# Altium schematic sheet 最小系统.SchDoc
size A4
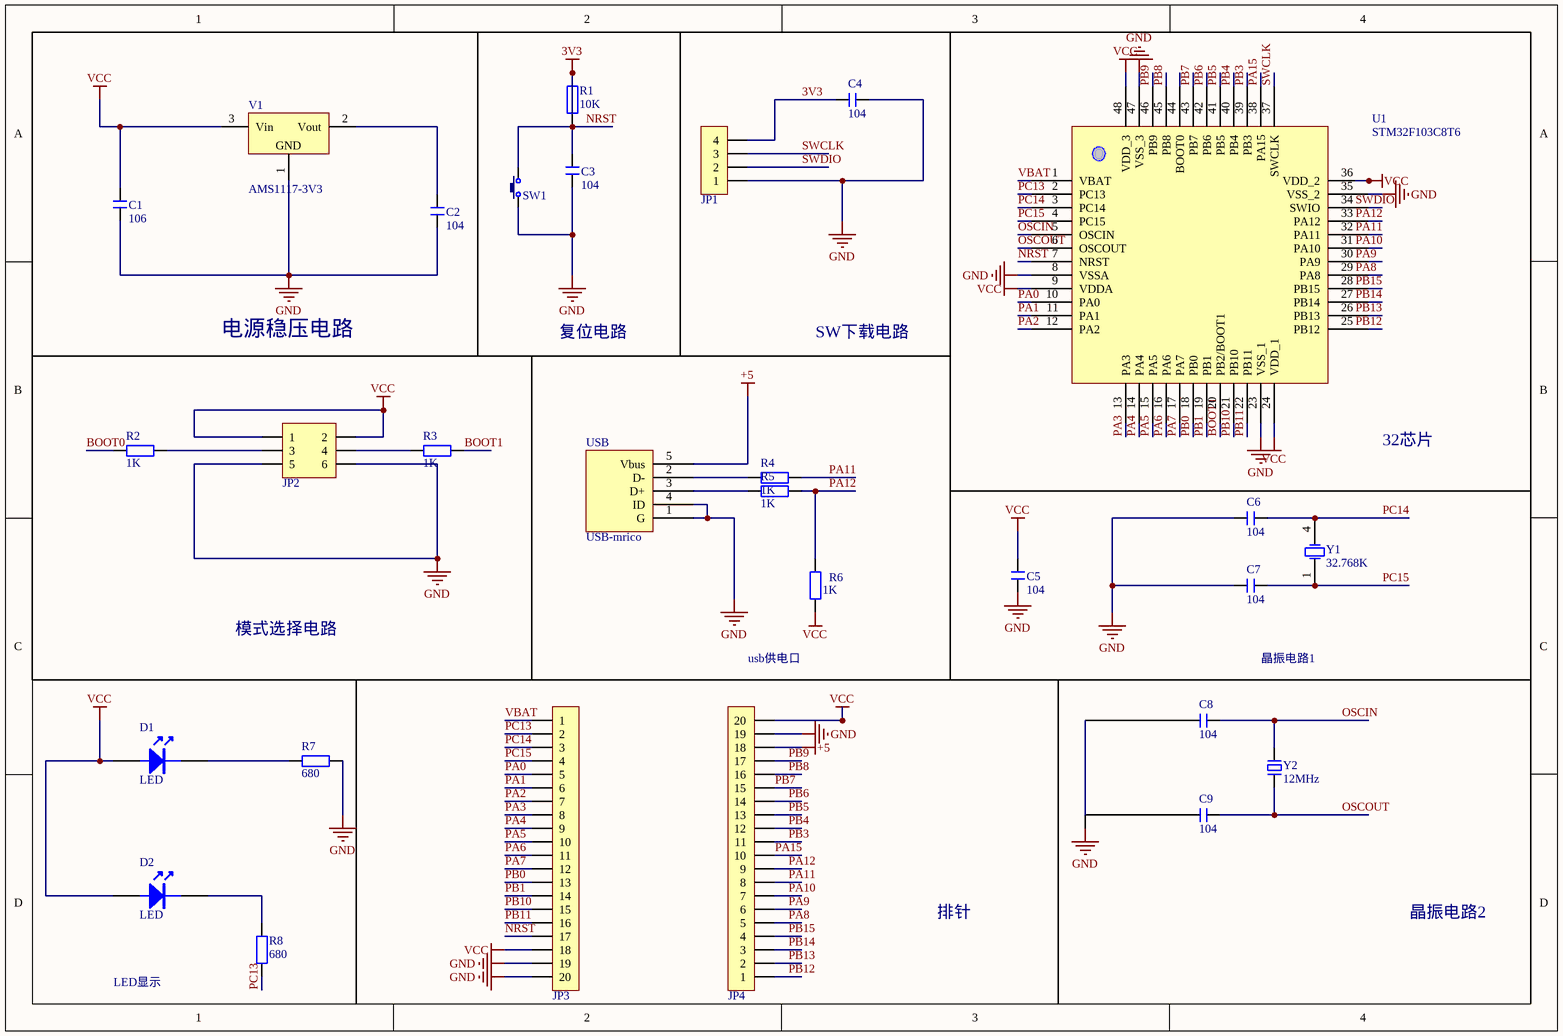
[diagram p0: 最小系统.SchDoc]

## Parts
C1  106  [C 0201_L]
C2  104  [C 0201_L]
C3  104  [C 0201_L]
C4  104  [C 0201_L]
C5  104  [C 0201_L]
C6  104  [C 0201_L]
C7  104  [C 0201_L]
C8  104  [C 0201_L]
C9  104  [C 0201_L]
D1  LED  [LED 0805G]
D2  LED  [LED 0805G]
JP1  HDR-1X4  [XH2.54-WI-4P]  (value not drawn)
JP2  Header3X2  [IDC2.54-LI-2x3P]  (value not drawn)
JP3  HDR-1X20  [HDR2.54-LI-20P]  (value not drawn)
JP4  HDR-1X20  [HDR2.54-LI-20P]  (value not drawn)
R1  10K  [R 0201_L]
R2  1K  [R 0201_L]
R3  1K  [R 0201_L]
R4  1K  [R 0201_L]
R5  1K  [R 0201_L]
R6  1K  [R 0201_L]
R7  680  [R 0201_L]
R8  680  [R 0201_L]
SW1  3x6x5  [TSW SMD-3*6*2.5]  (value not drawn)
U1  STM32F103C8T6  [TQFP48 7x7_L]
USB  USB-mrico  [USB-micro_B]
V1  AMS1117-3V3  [SOT223_L]
Y1  32.768K  [MC-306]
Y2  12MHz  [OSC HC-49S]

## Blocks framed on the sheet
电源稳压电路: C1 C2 V1

## Nets
3V3: C4.2 JP1.4 R1.2
+5: JP4.18 USB.5(Vbus)
GND: C1.1 C2.1 C3.1 C4.1 C5.1 C6.2 C7.2 JP1.1 JP2.5 JP2.6 JP3.19 JP3.20 JP4.19 R7.1 SW1.1 U1.8(VSSA) U1.23(VSS_1) U1.35(VSS_2) U1.47(VSS_3) USB.1(G) USB.4(ID) V1.1(GND)
VCC: C1.2 C5.2 D1.1 D2.1 JP2.1 JP2.2 JP3.18 JP4.20 R6.1 U1.9(VDDA) U1.24(VDD_1) U1.36(VDD_2) U1.48(VDD_3) V1.3(Vin)
BOOT0: R2.1
BOOT1: R3.2 U1.20(PB2/BOOT1)
NRST: C3.2 JP3.17 R1.1 SW1.2 U1.7(NRST)
OSCIN: C8.2 U1.5(OSCIN) Y2.2
OSCOUT: C9.2 U1.6(OSCOUT) Y2.1
PA0: JP3.5 U1.10(PA0)
PA1: JP3.6 U1.11(PA1)
PA2: JP3.7 U1.12(PA2)
PA3: JP3.8 U1.13(PA3)
PA4: JP3.9 U1.14(PA4)
PA5: JP3.10 U1.15(PA5)
PA6: JP3.11 U1.16(PA6)
PA7: JP3.12 U1.17(PA7)
PA8: JP4.5
PA9: JP4.6
PA10: JP4.7
PA11: JP4.8 R4.2
PA12: JP4.9 R5.2 R6.2
PA15: JP4.10 U1.38(PA15)
PB0: JP3.13 U1.18(PB0)
PB1: JP3.14 U1.19(PB1)
PB3: JP4.11 U1.39(PB3)
PB4: JP4.12 U1.40(PB4)
PB5: JP4.13 U1.41(PB5)
PB6: JP4.14 U1.42(PB6)
PB7: JP4.15 U1.43(PB7)
PB8: JP4.16 U1.45(PB8)
PB9: JP4.17 U1.46(PB9)
PB10: JP3.15 U1.21(PB10)
PB11: JP3.16 U1.22(PB11)
PB12: JP4.1
PB13: JP4.2
PB14: JP4.3
PB15: JP4.4
PC13: JP3.2 R8.2 U1.2(PC13)
PC14: C6.1 JP3.3 U1.3(PC14) Y1.4(OSC2)
PC15: C7.1 JP3.4 U1.4(PC15) Y1.1(OSC1)
SWCLK: JP1.3 U1.37(SWCLK)
SWDIO: JP1.2
VBAT: JP3.1 U1.1(VBAT)
NetC2_2: C2.2 V1.2(Vout)
NetD1_2: D1.2 R7.2
NetD2_2: D2.2 R8.1
NetJP2_3: JP2.3 R2.2
NetJP2_4: JP2.4 R3.1
NetR4_1: R4.1 USB.2(D-)
NetR5_1: R5.1 USB.3(D+)

Not connected (* = marked no-connect by the designer): C8 1; C9 1; U1 25(PB12) 26(PB13) 27(PB14) 28(PB15) 29(PA8) 30(PA9) 31(PA10) 32(PA11) 33(PA12) 34(SWIO) 44(BOOT0)

## Notes on the sheet
- 复位电路
- SW下载电路
- 32芯片
- 模式选择电路
- usb供电口
- 晶振电路1
- 排针
- 晶振电路2
- LED显示
- Labels drawn without touching a wire or pin: GND, PA8, PA9, PA10, PA11, PA12, PB12, PB13, PB14, PB15, SWDIO

## Library data of the parts
C1-C9 = C: 贴片电容; BOM名称: 无极性贴片电容; 淘宝ID: 封装库来自淘宝 ID：黄晶宝石; 联系售后，技术支持: https://shop463601444.taobao.com; 唯一出售店铺网址: https://shop463601444.taobao.com
JP1 = Header 4: 4P接插件; 版权归属: 封装库来自淘宝 ID：黄晶宝石; BOM名称: 4P接插件; 学习资源: https://shop463601444.taobao.com
JP2 = Header 3X2: 3*2P接插件; 版权归属: 封装库来自淘宝 ID：黄晶宝石; BOM名称: 3*2P接插件; 学习资源: https://shop463601444.taobao.com
JP3 JP4 = Header 20: 20P接插件; 版权归属: 封装库来自淘宝 ID：黄晶宝石; BOM名称: 20P接插件; 学习资源: https://shop463601444.taobao.com
R1-R8 = R: 贴片电阻; 版权归属: 来自淘宝 ID：黄晶宝石; 封装库来自淘宝卖家 ID：黄晶宝石: 其他店铺购入均为盗版，不享受售后技术支持服务，请立即申请退款; BOM名称: 贴片电阻; 联系售后: https://shop463601444.taobao.com
SW1 = TSW 3x6: 3x6轻触开关; 版权归属: 封装库来自淘宝 ID：黄晶宝石; BOM名称: 3x6轻触开关; 学习资源: https://shop463601444.taobao.com
USB = usb-STM
V1 = AMS1117: 三端稳压芯片; BOM名称: 稳压芯片; 淘宝ID: 封装库来自淘宝 ID：黄晶宝石; 欢迎光临淘宝店铺: https://shop463601444.taobao.com
Y1 = XTAL: Published: 8-Jun-2000; LatestRevisionDate: 17-Jul-2002; LatestRevisionNote: Re-released for DXP Platform.; Publisher: Altium Limited
Y2 = XTAL-2P: 2脚无源脚晶振; 版权归属: 封装库来自淘宝卖家 ID：黄晶宝石; BOM名称: 2脚无源脚晶振; 学习资源: https://shop463601444.taobao.com